# EasyEDA Pro project ProPrj_风扇可调供电_2025-12-10.epro

# Schematic Schematic1
Board Name: fan_control; Create Date: 2025-11-17; Page Name: P1; Project Name: 风扇可调供电; Schematic Name: Schematic1; Update Date: 2025-12-03; Company: 嘉立创EDA; Page Size: A4; Version: V1.0
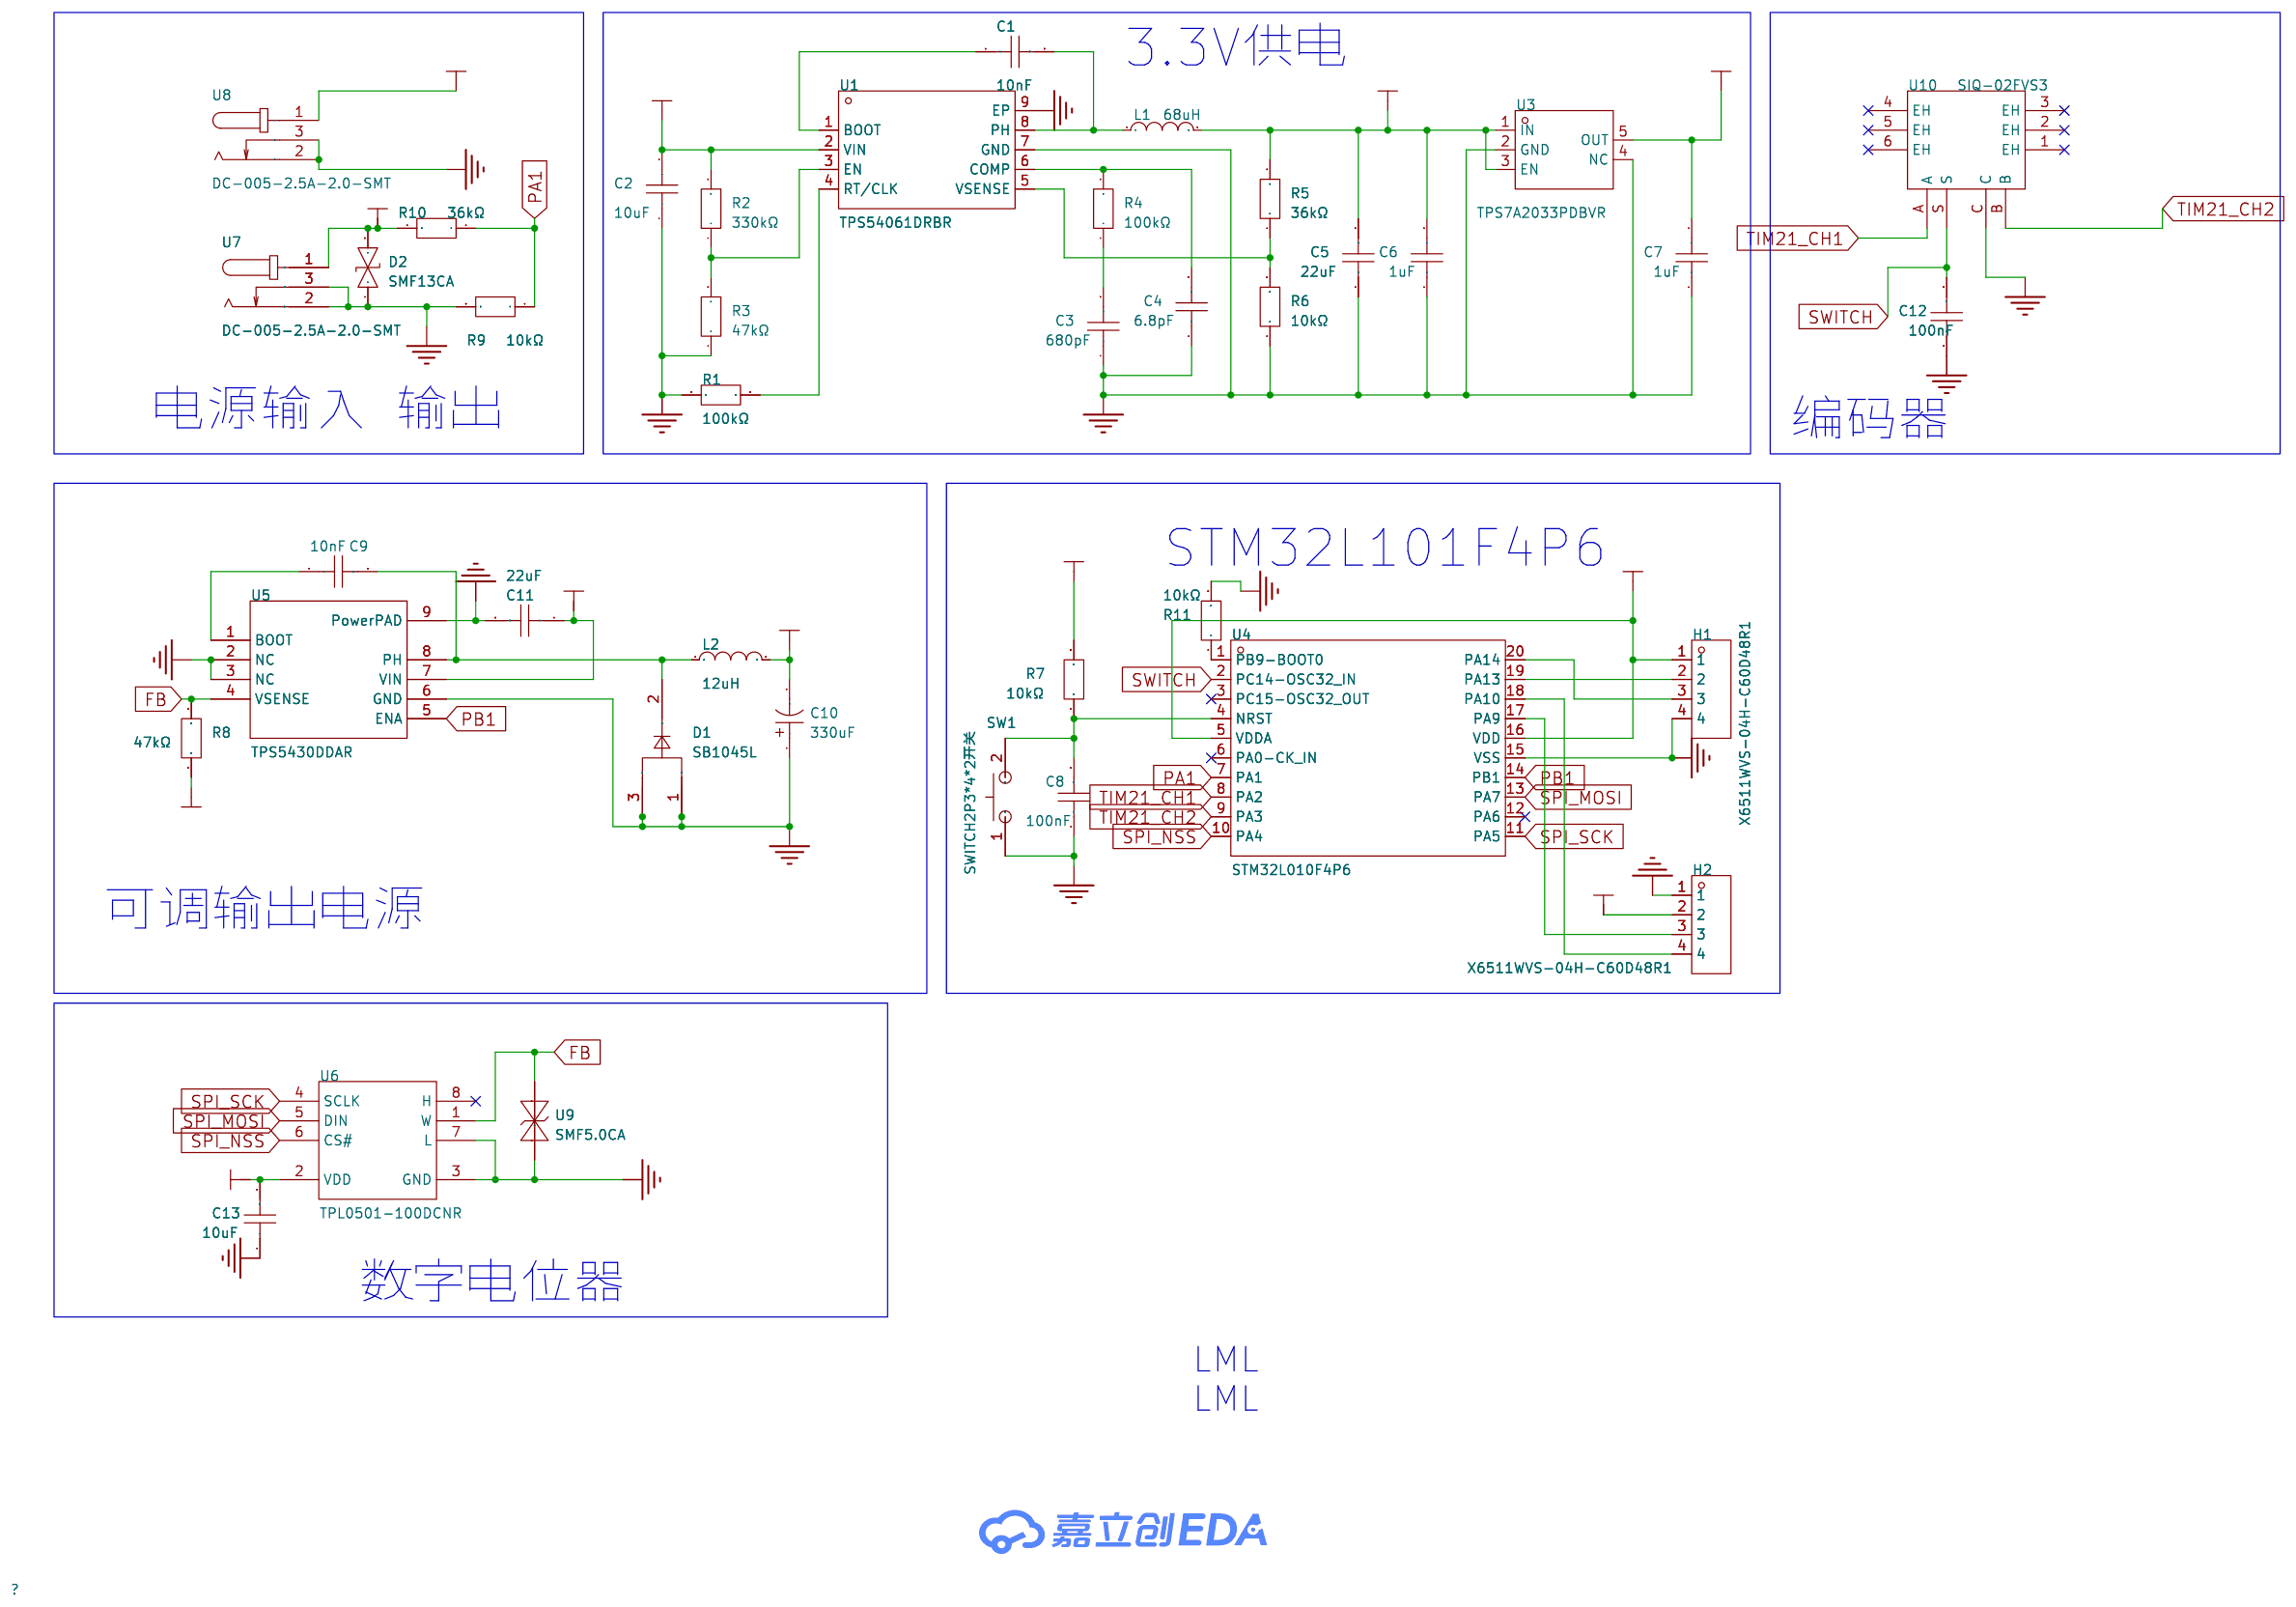
[diagram p0: schematic sheet]

## Parts
C1  10nF  [C0603]
C2  10uF  [C0603]
C3  680pF  [C0603]
C4  6.8pF  [C0603]
C5  22uF  [C0805]
C6  1uF  [C0603]
C7  1uF  [C0603]
C8  100nF  [C0603]
C9  10nF  [C0603]
C10  330uF  [CAP-SMD_BD10.0-L10.3-W10.3-SV331M250G12R7R1Z00ZZ]
C11  22uF  [C0805]
C12  100nF  [C0603]
C13  10uF  [C0603]
D1  SB1045L  [TO-277_3P-L5.4-W4.0-LS6.5-TR]
D2  SMF13CA  [SOD-123FL_L2.7-W1.8-LS3.8-BI]
H1  X6511WVS-04H-C60D48R1  [HDR-SMD_4P-P2.54-V-M-S4.8]
H2  X6511WVS-04H-C60D48R1  [HDR-SMD_4P-P2.54-V-M-S4.8]
L1  68uH  [IND-SMD_L4.5-W4.0_SCCD43]
L2  12uH  [IND-SMD_L12.0-W12.0_744771008]
R1  100kΩ  [R0603]
R2  330kΩ  [R0603]
R3  47kΩ  [R0603]
R4  100kΩ  [R0603]
R5  36kΩ  [R0603]
R6  10kΩ  [R0603]
R7  10kΩ  [R0603]
R8  47kΩ  [R0603]
R9  10kΩ  [R0603]
R10  36kΩ  [R0603]
R11  10kΩ  [R0603]
SW1  SWITCH2P3*4*2开关  [SW-SMD_L3.9-W2.9-P4.15-LS5.0-EH]
U1  TPS54061DRBR  [SON-8_L3.0-W3.0-P0.65-TL-EP]
U3  TPS7A2033PDBVR  [SOT-23-5_L2.9-W1.6-P0.95-LS2.8-BR]
U4  STM32L010F4P6  [TSSOP-20_L6.5-W4.4-P0.65-LS6.4-BL]
U5  TPS5430DDAR  [ESOP-8_L4.9-W3.9-P1.27-LS6.0-TL-EP]
U6  TPL0501-100DCNR  [SOT-23-8_L3.0-W1.7-P0.65-LS2.8-BL]
U7  DC-005-2.5A-2.0-SMT  [DC-IN-TH_XKB_DC-005-2.5A-2.5-SMT]
U8  DC-005-2.5A-2.0-SMT  [DC-IN-TH_XKB_DC-005-2.5A-2.5-SMT]
U9  SMF5.0CA  [SOD-123FL_L2.8-W1.8-LS3.7-BI]
U10  SIQ-02FVS3  [SW-SMD_SIQ-02FVS3_1]

## Library data of the parts
C1 C8 C9 = AC0603KPX7R9BB103: 容值:10nF;精度:±10%;额定电压:50V;温度系数:X7R;; LCSC Part Name: 10nF ±10% 50V; Supplier Part: C2172124; Manufacturer: YAGEO(国巨); Supplier Footprint: 0603; JLCPCB Part Class: 扩展库; Datasheet: https://item.szlcsc.com/datasheet/AC0603KPX7R9BB103/2264190.html; Supplier: LCSC; Tolerance: ±10%; Voltage Rating: 50V; Temperature Coefficient: X7R
C2-C7 C11-C13 = GRM188Z71C475KE21J: 容值:4.7uF;精度:±10%;额定电压:16V;温度系数:X7R;; LCSC Part Name: 4.7uF ±10% 16V; Supplier Part: C3844215; Manufacturer: muRata(村田); Supplier Footprint: 0603; JLCPCB Part Class: 扩展库; Datasheet: https://item.szlcsc.com/datasheet/GRM188Z71C475KE21J/4412698.html; Supplier: LCSC; Tolerance: ±10%; Voltage Rating: 16V; Temperature Coefficient: X7R
C10 = SV331M250G12R7R1Z00ZZ: 容值:330uF;精度:±20%;额定电压:25V;纹波电流:-;等效串联电阻(ESR):-;类型:聚合物;; LCSC Part Name: 330uF ±20% 25V; Supplier Part: C48542934; Manufacturer: 创慧电子; Supplier Footprint: SMD,D10xL12.7mm; JLCPCB Part Class: 扩展库; Datasheet: https://item.szlcsc.com/datasheet/SV331M250G12R7R1Z00ZZ/50804218.html; Supplier: LCSC; Tolerance: ±20%; Voltage Rating: 25V; Type: 聚合物; Pin Spacing: 5mm; Diameter: 10mm; Height - Seated (Max): 12.7mm; Lifetime: 2000hrs@105℃; Operating Temperature: -55℃~+105℃
D1 = SB1045L_C5199106: 二极管配置:独立式;正向压降(Vf):530mV@10A;直流反向耐压(Vr):45V;整流电流:10A;; LCSC Part Name: IF:10A VR:45V VF:0.53V IFSM:150A; Supplier Part: C5199106; Manufacturer: HXY MOSFET(华轩阳电子); Supplier Footprint: TO-277; JLCPCB Part Class: 扩展库; Datasheet: https://atta.szlcsc.com/upload/public/pdf/source/20240930/D1FEAD36E1BD0228299004254FB623C2.pdf; Supplier: LCSC; Diode Configuration: 独立式; Voltage - Forward(Vf@If): 530mV@10A; Voltage - DC Reverse(Vr): 45V; Current - Rectified: 10A; Reverse Leakage Current (Ir): 150uA@45V
D2 = SMF13CA_C19077508: 极性:双向;反向截止电压(Vrwm):13V;钳位电压:21.5V;峰值脉冲电流(Ipp):9.3A@10/1000us;峰值脉冲功率(Ppp):200W@10/1000us;击穿电压:15.9V;; LCSC Part Name: 双向TVS 13V截止 峰值浪涌电流：9.3A@10/1000us; Supplier Part: C19077508; Manufacturer: R+O(宏嘉诚); Supplier Footprint: SOD-123FL; JLCPCB Part Class: Extended Part; Datasheet: https://item.szlcsc.com/datasheet/SMF13CA/20275593.html; Supplier: LCSC; Polarity: 双向; Reverse Stand-Off Voltage (Vrwm): 13V; Clamping Voltage: 21.5V; Peak Pulse Current (Ipp): 9.3A@10/1000us; Peak Pulse Power Dissipation (Ppp): 200W@10/1000us; Voltage - Breakdown: 15.9V; Reverse Leakage Current (Ir): 1uA; Operating Temperature: -55℃~+150℃; level of protection: IEC 61000-4-2; Type: TVS
H1 H2 = X6511WVS-04H-C60D48R1: 插针结构:1x4P;间距:2.54mm;行距:2.54mm;圆针/方针:方针;排数:单排;总PIN位数:4P;额定电流:3A;额定电压:250V;配合针长度:-;塑高:2.5mm;端接针长度:-;触头材质:黄铜;触头镀层:金;工作温度:-40℃~+105℃;颜色:黑色;; LCSC Part Name: 1x4P 间距:2.54mm 方针; Supplier Part: C780062; Manufacturer: XKB Connection(中国星坤); Supplier Footprint: SMD,P=2.54mm; JLCPCB Part Class: Extended Part; Datasheet: https://item.szlcsc.com/datasheet/X6511WVS-04H-C60D48R1/831912.html; Supplier: LCSC; Pin Structure: 1x4P; Pitch: 2.54mm; Row Spacing: 2.54mm; Circluar Pins/Square Pins: 方针; Number of Rows: 单排; Number of Pins: 4P; Current Rating: 3A; Voltage Rating (Max): 250V; Insulation Height: 2.5mm; Contact Material: 黄铜; Contact Plating: 金; Operating Temperature: -40℃~+105℃; Color: 黑色
L1 = 784787680: 电感值:68uH;精度:±25%;饱和电流(Isat):1A;; LCSC Part Name: 68uH ±25% 1A; Supplier Part: C5917525; Manufacturer: Wurth(伍尔特); Supplier Footprint: SMD,7.8x7mm; JLCPCB Part Class: 扩展库; Datasheet: https://www.we-online.com/components/products/datasheet/784787680.pdf; Supplier: LCSC; Tolerance: ±25%; Current - Saturation(Isat): 1A; DC Resistance(DCR): 290mΩ; Ratings: AEC-Q200
L2 = 744771112: 电感值:12uH;精度:±20%;额定电流:3.91A;饱和电流(Isat):4.85A;; LCSC Part Name: 12uH ±20% 4.85A; Supplier Part: C2045656; Manufacturer: Wurth(伍尔特); Supplier Footprint: SMD,12x12mm; JLCPCB Part Class: 扩展库; Datasheet: https://www.we-online.com/components/products/datasheet/744771112.pdf; Supplier: LCSC; Tolerance: ±20%; Current Rating: 3.91A; Current - Saturation(Isat): 4.85A; DC Resistance(DCR): 27mΩ; Ratings: AEC-Q200
R1-R11 = GR0603F180KT5G00: 电阻类型:厚膜电阻;阻值:180kΩ;精度:±1%;功率:100mW;工作电压:75V;温度系数:±100ppm/℃;; LCSC Part Name: 180K ±1%; Supplier Part: C49653111; Manufacturer: GiantOhm(鼎声微电); Supplier Footprint: 0603; JLCPCB Part Class: 扩展库; Datasheet: https://item.szlcsc.com/datasheet/GR0603F180KT5G00/52210696.html; Supplier: LCSC; Type: 厚膜电阻; Tolerance: ±1%; Power(Watts): 100mW; Voltage-Supply(Max): 75V; Temperature Coefficient: ±100ppm/℃; Operating Temperature: -55℃~+155℃
SW1 = SWITCH2P3*4*2开关: Supplier Part: C9900004128; Supplier Footprint: SMD; JLCPCB Part Class: 扩展库; Supplier: LCSC
U1 = TPS54061DRBR: 功能类型:降压型;输出类型:可调;工作电压:4.7V~60V;输出电压:800mV~58V;输出电流:200mA;; LCSC Part Name: 60V 200mA同步降压DC-DC转换器; Supplier Part: C113613; Manufacturer: TI(德州仪器); Supplier Footprint: SON-8-EP(3x3); JLCPCB Part Class: 扩展库; Datasheet: https://www.ti.com/cn/lit/gpn/tps54061; Supplier: LCSC; Function: 降压型; Output Type: 可调; Input Voltage: 4.7V~60V; Output Voltage: 800mV~58V; Output Current: 200mA; Switching Frequency: 1.1MHz; Operating Temperature: -40℃~+150℃@(TJ); Synchronous Rectification: 是; Number of Outputs: 1; Topology: 降压式; Switch tube (built-in/external): 内置
U3 = TPS7A2033PDBVR: 输出类型:固定;最大输入电压:6V;输出电压:3.3V;输出电流:300mA;输出极性:正极;; LCSC Part Name: 具有高 PSRR 的 300mA、超低噪声、低 IQ、低压降 (LDO) 线性稳压器; Supplier Part: C2862740; Manufacturer: TI(德州仪器); Supplier Footprint: SOT-23-5; JLCPCB Part Class: 扩展库; Datasheet: https://www.ti.com/cn/lit/gpn/tps7a20; Supplier: LCSC; Output Type: 固定; Maximum Input Voltage: 6V; Output Voltage: 3.3V; Output Current: 300mA; Dropout Voltage: 140mV@(300mA); standby current: 15uA; Feature: 防静电保护；软启动；浪涌保护；低ESR；热保护(TSD)；欠压闭锁；过流保护(OCP)；带使能；防倒灌; Operating Temperature: -40℃~+125℃@(Tj); Output Polarity: 正极; Number of Outputs: 1
U4 = STM32L010F4P6: CPU内核:ARM-M系列;CPU最大主频:32MHz;应用领域:-;; LCSC Part Name: 超低功耗超值系列Arm Cortex-M0+ MCU，具有16-KB Flash存储器和32 MHz CPU; Supplier Part: C529415; Manufacturer: ST(意法半导体); Supplier Footprint: TSSOP-20; JLCPCB Part Class: 扩展库; Datasheet: https://item.szlcsc.com/datasheet/STM32L010F4P6/549643.html; Supplier: LCSC; CPU Core: ARM-M系列; CPU Maximum Speed: 32MHz; Program Storage Size: 16KB; Program Memory Type: FLASH; Number of I/O: 16; ADC (Bit): 12bit; Voltage - Supply: 1.8V~3.6V
U5 = TPS5430DDAR: 功能类型:降压型;工作电压:5.5V~36V;输出电压:1.221V~32.04V;输出电流:3A;输出类型:可调;; LCSC Part Name: 宽输入范围、3A输出电流的降压转换器; Supplier Part: C9864; Manufacturer: TI(德州仪器); Supplier Footprint: SOIC-8-EP; JLCPCB Part Class: 基础库; Datasheet: https://www.ti.com/lit/ds/symlink/tps5430.pdf; Supplier: LCSC; Function: 降压型; Voltage - Supply: 5.5V~36V; Output Voltage: 1.221V~32.04V; Output Current: 3A; Frequency - Switching: 500kHz; Operating Temperature: -40℃~+125℃@(TJ); Synchronous Rectifier: 否; Number of Outputs: 1; Topology: 降压式; Quiescent Current: 4.4mA; Switch tube (built-in/external): 内置; Output Type: 可调
U6 = TPL0501-100DCNR: 电阻值(欧姆):100kΩ;接口类型:SPI;供电电压:2.7V~5.5V;精度:±20%;; Supplier Part: C131323; Manufacturer: TI(德州仪器); Supplier Footprint: SOT-23-8; JLCPCB Part Class: 扩展库; Datasheet: https://www.ti.com/cn/lit/gpn/tpl0501-100; Supplier: LCSC; Resistance Value (Ohms): 100kΩ; Number of Taps: 256; Interface Type: SPI; Number of Channels: 1; Supply Voltage: 2.7V~5.5V; Precision: ±20%; Temperature Coefficient (Typ): 35ppm/℃; Operating Temperature: -40℃~+125℃
U7 U8 = DC-005-2.5A-2.0-SMT: 连接器类型:DC电源插座;安装方式:卧贴;触点内径:2mm;触点外径:6.5mm;额定电流:2.5A;额定电压:24V;工作温度:-;; LCSC Part Name: DC电源插座 内径:2mm 外径:6.5mm; Supplier Part: C2880543; Manufacturer: XKB Connection(中国星坤); Supplier Footprint: SMD; JLCPCB Part Class: 扩展库; Datasheet: https://item.szlcsc.com/datasheet/DC-005-2.5A-2.0-SMT/3091035.html; Supplier: LCSC; Connector Type: DC电源插座; Mounting Type: 卧贴; Inside Contact Diameter: 2mm; Outside Contact Diameter: 6.5mm; Current Rating: 2.5A; Voltage Rating (Max): 24V
U9 = SMF5.0CA: 反向截止电压(Vrwm):5V;最大钳位电压:9.2V;峰值脉冲电流(Ipp):21.7A;峰值脉冲功率(Ppp):200W;击穿电压:6.4V;; Supplier Part: C2985633; Manufacturer: KUU; Supplier Footprint: SOD-123FL; JLCPCB Part Class: 扩展库; Datasheet: https://atta.szlcsc.com/upload/public/pdf/source/20211206/852276409897768D6E4CD85BFA43719B.pdf; Supplier: LCSC; Reverse Stand-Off Voltage (Vrwm): 5V; Maximum Clamping Voltage: 9.2V; Peak Pulse Current (Ipp): 21.7A; Peak Pulse Power Dissipation (Ppp): 200W; Breakdown Voltage: 6.4V; Reverse Leakage Current (Ir): 400uA; Type: TVS
U10 = SIQ-02FVS3: LCSC Part Name: 拨轮滚轮旋转编码器开关; Supplier Part: C2925423; Manufacturer: MITSUMI(美上美); Supplier Footprint: SMD; JLCPCB Part Class: 扩展库; Datasheet: https://atta.szlcsc.com/upload/public/pdf/source/20220728/2FBC1A98A06DC86460FC69DAE20456FC.pdf; Supplier: LCSC

## Nets
+3.3V: C7.2 C13.2 H1.1 H2.2 R7.2 U3.5(OUT) U4.5(VDDA) U4.16(VDD) U6.2(VDD)
+3.6V: C5.2 C6.2 L1.2 R5.2 U3.1(IN) U3.3(EN)
+8V: C10.2 D2.2(A) L2.2 R8.1 R10.2 U7.1
+12V: C2.2 C11.1 R2.2 U1.2(VIN) U5.7(VIN) U8.1
GND: C2.1 C3.1 C4.1 C5.1 C6.1 C7.1 C8.1 C10.1 C11.2 C12.1 C13.1 D1.1(A) D1.3(A) D2.1(K) H1.4 H2.1 R1.1 R3.1 R6.1 R9.2 R11.2 SW1.1 U1.7(GND) U1.9(EP) U3.2(GND) U3.4(NC) U4.15(VSS) U5.2(NC) U5.3(NC) U5.6(GND) U5.9(PowerPAD) U6.3(GND) U6.7(L) U7.2 U7.3 U8.2 U8.3 U9.1 U10.C
FB: R8.2 U5.4(VSENSE) U6.1(W) U9.2
PA1: R9.1 R10.1 U4.7(PA1)
PB1: U4.14(PB1) U5.5(ENA)
SPI_MOSI: U4.13(PA7) U6.5(DIN)
SPI_NSS: U4.10(PA4) U6.6(CS#)
SPI_SCK: U4.11(PA5) U6.4(SCLK)
SWITCH: C12.2 U4.2(PC14-OSC32_IN) U10.S
TIM21_CH1: U4.8(PA2) U10.A
TIM21_CH2: U4.9(PA3) U10.B
$1N331: C1.2 L1.1 U1.8(PH)
$1N337: C1.1 U1.1(BOOT)
$1N630: R2.1 R3.2 U1.3(EN)
$1N740: C4.2 R4.2 U1.6(COMP)
$1N792: C3.2 R4.1
$1N1065: R5.1 R6.2 U1.5(VSENSE)
$1N1657: R1.2 U1.4(RT/CLK)
$1N2746: H1.2 U4.19(PA13)
$1N2752: H1.3 U4.20(PA14)
$1N2774: C8.2 R7.1 SW1.2 U4.4(NRST)
$1N3503: C9.1 U5.1(BOOT)
$1N6525: H2.3 U4.17(PA9)
$1N6531: H2.4 U4.18(PA10)
$1N12295: C9.2 D1.2(C) L2.1 U5.8(PH)
$1N12915: R11.1 U4.1(PB9-BOOT0)

Not connected (* = marked no-connect by the designer): U4 3(PC15-OSC32_OUT)* 6(PA0-CK_IN)* 12(PA6)*; U6 8(H)*; U10 1(EH)* 2(EH)* 3(EH)* 4(EH)* 5(EH)* 6(EH)*

## Notes on the sheet
- 3.3V供电
- 电源输入 输出
- 编码器
- STM32L101F4P6
- 可调输出电源
- 数字电位器
- LML
- LML

# Board PCB1
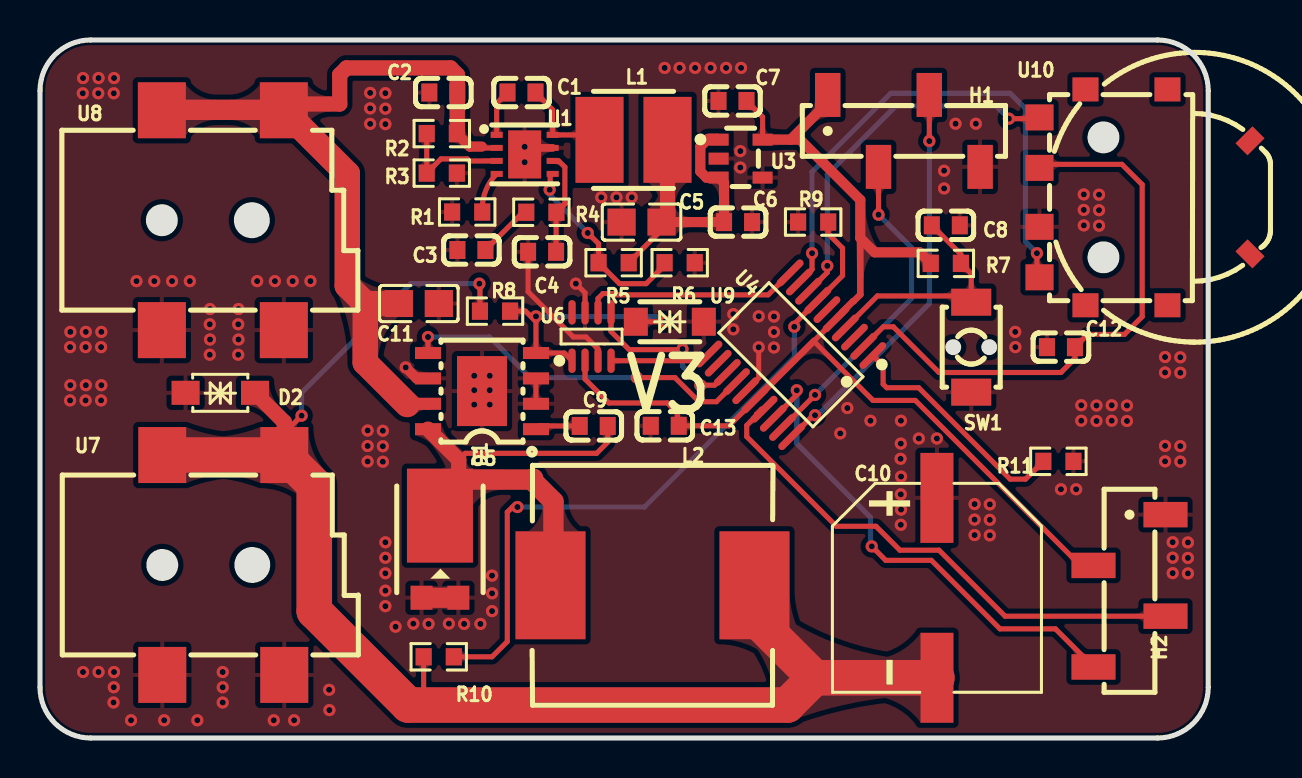
[diagram p1: board, top side]
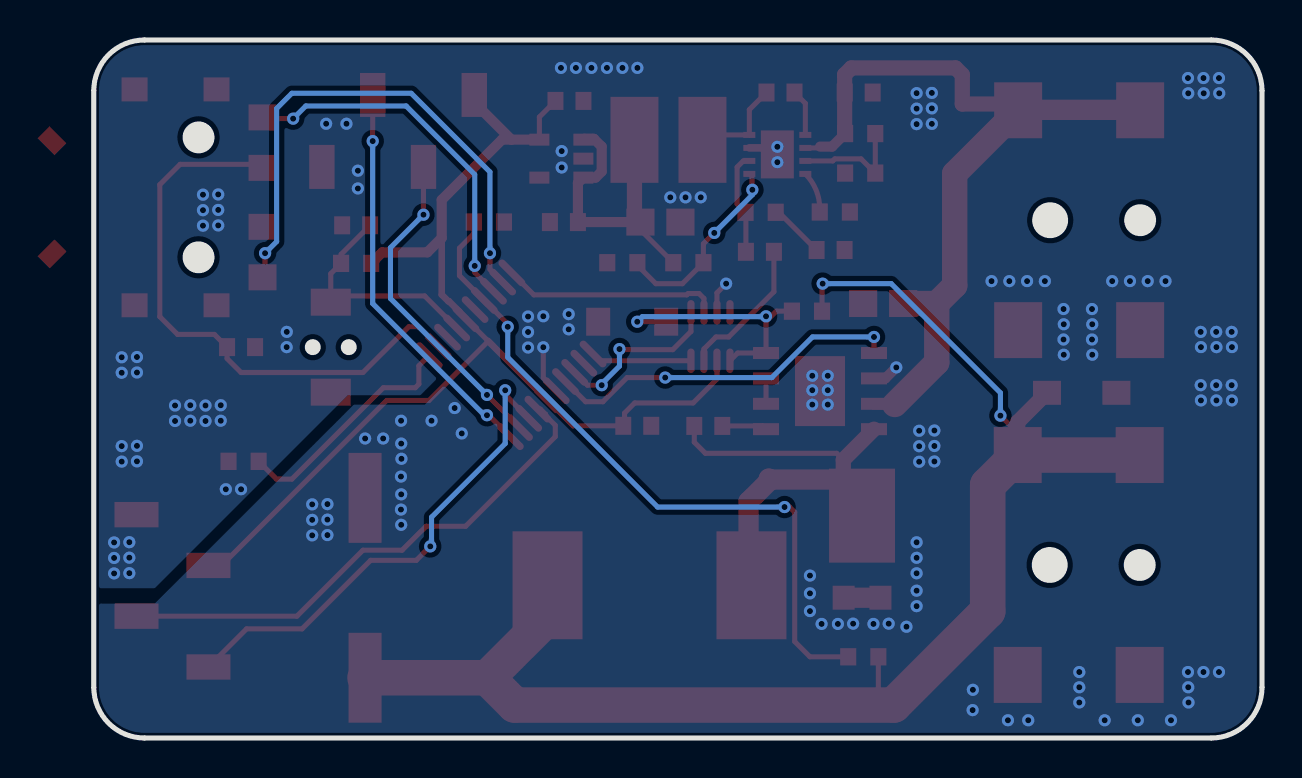
[diagram p2: board, bottom side, seen from below]

Outline 58.42 x 34.92 mm; copper layers: Top Layer, Bottom Layer. Coordinates in mm from the lower left corner of the outline.
Outline path: 0,32.38 0,2.54 arc(0.74,0.74) 2.54,0 55.88,0 arc(57.68,0.74) 58.42,2.54 58.42,32.38 arc(57.68,34.18) 55.88,34.92 2.54,34.92 arc(0.74,34.18) 0,32.38
Stack: Top Layer 0.035mm / Dielectric1 1.51mm FR4 er 4.5 / Bottom Layer 0.035mm

## Design rules (mm)
template: 自定义配置
spacing copperThickness1oz (default): track to track 0.102, other pairs 0.152 to 0.3
spacing copperThickness2oz: track to track 0.203, other pairs 0.152 to 0.3
spacing 12v: track to track 0.305, other pairs 0.051 to 0.305
track width copperThickness1oz (default): min 0.127, default 0.254, max 2.54
track width copperThickness2oz: min 0.203, default 0.254, max 2.54
differential pair differentialPair (default): width min 0.127, default 0.254, max 2.54; gap min 0.152, default 0.152
via viaSize (default): diameter min 0.5, default 0.61, max 10; hole min 0.3, default 0.305, max 6.3
pour e314 uses copperRegion

## Placement (name value [footprint] x y rotation side)
C1  10nF  [C0603]  24.08 32.3 0 top
C2  10uF  [C0603]  20.17 32.3 0 top
C3  680pF  [C0603]  21.57 24.42 0 top
C4  6.8pF  [C0603]  25.11 24.33 0 top
C5  22uF  [C0805]  30.08 25.81 0 top
C6  1uF  [C0603]  34.91 25.81 180 top
C7  1uF  [C0603]  34.63 31.88 0 top
C8  100nF  [C0603]  45.3 25.65 180 top
C9  10nF  [C0603]  27.69 15.61 0 top
C10  330uF  [CAP-SMD_BD10.0-L10.3-W10.3-SV331M250G12R7R1Z00ZZ]  44.85 7.51 270 top
C11  22uF  [C0805]  18.94 21.74 0 top
C12  100nF  [C0603]  51.05 19.56 0 top
C13  10uF  [C0603]  31.24 15.62 0 top
D1  SB1045L  [TO-277_3P-L5.4-W4.0-LS6.5-TR]  20 9.07 270 top
D2  SMF13CA  [SOD-123FL_L2.7-W1.8-LS3.8-BI]  9.02 17.27 0 top
H1  X6511WVS-04H-C60D48R1  [HDR-SMD_4P-P2.54-V-M-S4.8]  43.2 30.37 0 top
H2  X6511WVS-04H-C60D48R1  [HDR-SMD_4P-P2.54-V-M-S4.8]  54.48 7.37 270 top
L1  68uH  [IND-SMD_L4.5-W4.0_SCCD43]  29.68 29.93 0 top
L2  12uH  [IND-SMD_L12.0-W12.0_744771008]  30.63 7.64 0 top
R1  100kΩ  [R0603]  21.36 26.32 0 top
R2  330kΩ  [R0603]  20.09 30.24 0 top
R3  47kΩ  [R0603]  20.09 28.26 180 top
R4  100kΩ  [R0603]  25.07 26.3 0 top
R5  36kΩ  [R0603]  28.69 23.78 0 top
R6  10kΩ  [R0603]  31.99 23.78 180 top
R7  10kΩ  [R0603]  45.3 23.75 180 top
R8  47kΩ  [R0603]  22.75 21.36 0 top
R9  10kΩ  [R0603]  38.66 25.81 180 top
R10  36kΩ  [R0603]  19.94 4.06 180 top
R11  10kΩ  [R0603]  50.93 13.84 0 top
SW1  SWITCH2P3*4*2开关  [SW-SMD_L3.9-W2.9-P4.15-LS5.0-EH]  46.57 19.56 90 top
U1  TPS54061DRBR  [SON-8_L3.0-W3.0-P0.65-TL-EP]  24.24 29.2 0 top
U3  TPS7A2033PDBVR  [SOT-23-5_L2.9-W1.6-P0.95-LS2.8-BR]  35.04 28.99 180 top
U4  STM32L010F4P6  [TSSOP-20_L6.5-W4.4-P0.65-LS6.4-BL]  37.55 19.17 135 top
U5  TPS5430DDAR  [ESOP-8_L4.9-W3.9-P1.27-LS6.0-TL-EP]  22.1 17.36 180 top
U6  TPL0501-100DCNR  [SOT-23-8_L3.0-W1.7-P0.65-LS2.8-BL]  27.58 20.09 0 top
U7  DC-005-2.5A-2.0-SMT  [DC-IN-TH_XKB_DC-005-2.5A-2.5-SMT]  9.17 8.66 0 top
U8  DC-005-2.5A-2.0-SMT  [DC-IN-TH_XKB_DC-005-2.5A-2.5-SMT]  9.14 25.91 0 top
U9  SMF5.0CA  [SOD-123FL_L2.8-W1.8-LS3.7-BI]  31.5 20.83 180 top
U10  SIQ-02FVS3  [SW-SMD_SIQ-02FVS3_1]  55.25 27.05 270 top

## Footprints (pads in the part's own frame, mm; a bottom-side part is the same pattern mirrored in y, then rotated)
C0603
  rect 0.8x0.9 smd: 1(-0.7,0) 2(0.7,0)
C0805
  rect 1.41x1.35 smd: 1(-1,0) 2(1,0)
CAP-SMD_BD10.0-L10.3-W10.3-SV331M250G12R7R1Z00ZZ
  rect 4.5x1.65 smd: 1(-4.5,0) 2(4.5,0)
DC-IN-TH_XKB_DC-005-2.5A-2.5-SMT
  rect 2.4x2.8 smd: 1(-3.05,5.5) 1(3.05,5.5) 2(-3.05,-5.5) 3(3.05,-5.5)
ESOP-8_L4.9-W3.9-P1.27-LS6.0-TL-EP
  rect 1.3x0.6 smd: 1(-2.7,1.905) 2(-2.7,0.635) 3(-2.7,-0.635) 4(-2.7,-1.905) 5(2.7,-1.905) 6(2.7,-0.635) 7(2.7,0.635) 8(2.7,1.905)
  rect 2.5x3.5 smd: 9(0,0)
HDR-SMD_4P-P2.54-V-M-S4.8
  rect 1.27x2.2 smd: 1(-3.81,1.8) 2(-1.27,-1.8) 3(1.27,1.8) 4(3.81,-1.8)
IND-SMD_L4.5-W4.0_SCCD43
  rect 2.4x4.3 smd: 1(-1.7,0) 2(1.7,0)
IND-SMD_L12.0-W12.0_744771008
  rect 3.5x5.4 smd: 1(-5.1,0) 2(5.1,0)
R0603
  rect 0.806x0.864 smd: 1(-0.753,0) 2(0.753,0)
SOD-123FL_L2.7-W1.8-LS3.8-BI
  rect 1.4x1.2 smd: 1(-1.735,0) 2(1.735,0)
SOD-123FL_L2.8-W1.8-LS3.7-BI
  rect 1.2x1.4 smd: 1(-1.7,0) 2(1.7,0)
SON-8_L3.0-W3.0-P0.65-TL-EP
  rect 0.6x0.3 smd: 1(-1.4,0.976) 2(-1.4,0.325) 3(-1.4,-0.325) 4(-1.4,-0.976) 5(1.4,-0.976) 6(1.4,-0.325) 7(1.4,0.325) 8(1.4,0.976)
  rect 1.65x2.4 smd: 9(0,0)
SOT-23-5_L2.9-W1.6-P0.95-LS2.8-BR
  rect 1x0.6 smd: 1(1.1,-0.95) 2(1.1,0) 3(1.1,0.95) 4(-1.1,0.95) 5(-1.1,-0.95)
SOT-23-8_L3.0-W1.7-P0.65-LS2.8-BL
  oval 0.364x1.222 smd: 1(-0.975,-1.211) 2(-0.325,-1.211) 3(0.325,-1.211) 4(0.975,-1.211) 5(0.975,1.211) 6(0.325,1.211) 7(-0.325,1.211) 8(-0.975,1.211)
SW-SMD_L3.9-W2.9-P4.15-LS5.0-EH
  rect 1.35x2 smd: 1(-2.25,0) 2(2.25,0)
SW-SMD_SIQ-02FVS3_1
  rect 1.2x1.3 smd: 1(5.4,-2.964) 2(5.4,1.136) 5(-5.4,1.136) 6(-5.4,-2.964)
  rect 0.85x1.2 smd rot 135: 3(2.829,5.264)
  rect 0.85x1.2 smd rot 45: 4(-2.829,5.264)
  rect 1.3x1.4 smd: A(-4,-5.264) B(4,-5.264) C(1.475,-5.264) S(-1.475,-5.264)
TO-277_3P-L5.4-W4.0-LS6.5-TR
  rect 1.2x1.1 smd: 1(2.054,0.92) 3(2.054,-0.92)
  rect 4.7x3.3 smd: 2(-2.054,0)
TSSOP-20_L6.5-W4.4-P0.65-LS6.4-BL
  oval 0.364x1.742 smd: 1(-2.925,-2.871) 2(-2.275,-2.871) 3(-1.625,-2.871) 4(-0.975,-2.871) 5(-0.325,-2.871) 6(0.325,-2.871) 7(0.975,-2.871) 8(1.625,-2.871) 9(2.275,-2.871) 10(2.925,-2.871) 11(2.925,2.871) 12(2.275,2.871) 13(1.625,2.871) 14(0.975,2.871) 15(0.325,2.871) 16(-0.325,2.871) 17(-0.975,2.871) 18(-1.625,2.871) 19(-2.275,2.871) 20(-2.925,2.871)

## Nets
As in the schematic.

Pads without a net: U4 3 6 12; U6 8; U10 1 2 3 4 5 6

## Via types
v1: diameter 0.61, hole 0.305, Top Layer to Bottom Layer, 179 vias

## Routing (per net, layer and track width the routed paths; a pad name or vN(x,y) marks a point on that pad's centre or on a via; arc(x,y) is an arc through that point)
+3.3V: length 57.2
  Top Layer w0.254: U4.5 38.71,19.87 38.71,19.84 41.66,16.89 43.77,16.89 52.03,8.64 H2.2 ; U6.2 27.26,17.96 28.45,16.76 31.37,16.76 31.88,16.26 31.88,15.62 34.46,15.62 U4.16 ; C7.2 36.14,31.07 U3.5
  Top Layer w0.33: U4.5 40.14,21.3 40.14,21.33 40.66,21.85 40.69,21.85 41.02,22.18 41.02,25.02 ; U4.16 38.71,19.87
  Top Layer w0.508: 39.39,31.79 37.54,29.94 ; 37.54,29.94 38.01,29.94 41.02,26.92 41.02,25.02 41.74,24.3 43.99,24.3 44.55,23.75 ; 37.54,29.94 U3.5
+3.6V: length 15.8
  Top Layer w0.254: R5.2 31.08,25.43 C5.2
  Top Layer w0.508: U3.3 34.21,27.77 C6.2 C5.2 ; 33.94,28.04 33.33,28.04 33.02,28.35 33.02,29.59 33.41,29.98 33.9,29.98 U3.1
  Top Layer w0.762: C5.2 31.38,26.11 L1.2
+8V: length 74.3
  Top Layer w0.254: R10.2 19.19,2.41 ; R8.1 22,22.7 v1(21.97,22.73) ; v1(13.08,16.13) 12.34,15.39 12.22,15.39 U7.1
  Top Layer w0.762: 12.22,15.39 12.22,15.81 D2.2
  Top Layer w1.778: 38.74,3.01 35.73,6.02 L2.2 ; 38.74,3.01 C10.2 ; 38.74,3.01 37.37,1.65 18.41,1.65 13.72,6.35 13.72,12.66 U7.1 U7.1
  Bottom Layer w0.254: v1(21.97,22.73) 18.54,22.73 13.08,17.27 v1(13.08,16.13)
+12V: length 42
  Top Layer w0.254: U1.2 22.16,29.52 22.1,29.59
  Top Layer w0.508: 18.36,16.69 19.4,16.69 19.4,16.72 ; R2.2 21.5,29.59 22.1,29.59
  Top Layer w0.762: 12.09,31.43 12.38,31.72 14.99,31.72 14.99,33.19 15.33,33.53 20.53,33.53 20.87,33.19 C2.2 20.87,30.3 arc(20.86,30.27) R2.2
  Top Layer w1.016: 12.09,31.43 5.99,31.43
  Top Layer w1.27: 16.26,21.74 15.37,22.64 15.37,28.23 U8.1 ; 16.26,21.74 16.26,18.79 18.36,16.69 ; 16.26,21.74 C11.1
GND: length 17.2
  Top Layer w0.254: U5.2 U5.3 ; v1(35.94,19.55) 35.94,18.02 U4.15 ; C4.1 24.41,22.33 26.67,20.07 27.31,20.07 27.91,19.47 U6.3 ; v1(26.8,22.73) 27.26,22.27 U6.7
  Top Layer w0.381: U1.7 24.29,29.52 v1(24.24,29.58)
  Top Layer w0.508: v1(18.29,18.54) 18.84,17.99 19.4,17.99
  Top Layer w1.016: D1.1 D1.3
  vias: v1(1.52,20.32) v1(1.5,19.56) v1(1.52,17.65) v1(1.5,16.89) v1(2.14,32.26) v1(2.15,33.02) v1(2.15,3.3) v1(2.29,20.32) v1(2.28,19.56) v1(2.29,17.65) v1(2.28,16.89) v1(2.93,33.02) v1(2.91,32.26) v1(2.93,3.3) v1(3.07,20.32) v1(3.05,19.56) v1(3.07,17.65) v1(3.05,16.89) v1(3.7,33.02) v1(3.69,32.26) v1(3.7,3.3) v1(3.69,2.54) v1(3.68,1.78) v1(4.55,0.89) v1(4.83,22.86) v1(5.72,22.86) v1(6.21,0.89) v1(6.6,22.86) v1(7.49,22.86) v1(7.87,0.89) v1(8.5,21.46) v1(8.49,20.7) v1(8.5,19.94) v1(8.49,19.18) v1(9.14,3.3) v1(9.14,2.54) v1(9.14,1.78) v1(9.93,21.46) v1(9.91,20.7) v1(9.93,19.94) v1(9.91,19.18) v1(10.86,22.86) v1(11.75,22.86) v1(11.69,0.89) v1(12.64,22.86) v1(12.71,0.89) v1(13.53,22.86) v1(14.46,2.41) v1(14.47,1.4) v1(16.38,15.39) v1(16.38,14.61) v1(16.38,13.84) v1(16.51,32.28) v1(16.51,31.5) v1(16.51,30.73) v1(17.15,15.37) v1(17.15,14.6) v1(17.15,13.82) v1(17.27,32.26) v1(17.27,31.49) v1(17.27,30.71) v1(17.27,9.79) v1(17.27,9.02) v1(17.27,8.24) v1(17.27,7.37) v1(17.27,6.6) v1(17.78,5.57) v1(18.67,5.72) v1(19.43,5.71) v1(20.45,5.72) v1(21.21,5.71) v1(21.72,18.12) v1(21.72,17.4) v1(21.72,16.68) v1(22.02,5.71) v1(22.49,18.12) v1(22.49,17.4) v1(22.49,16.68) v1(22.61,8.13) v1(22.61,7.24) v1(22.61,6.35) v1(24.24,28.81) v1(28.07,27.05) v1(28.83,27.05) v1(29.59,27.05) v1(31.24,33.53) v1(31.98,33.53) v1(32.76,33.53) v1(33.53,33.53) v1(34.31,33.53) v1(34.67,21.21) v1(34.67,20.45) v1(35.02,29.37) v1(35.02,28.54) v1(35.06,33.53) v1(35.94,21.1) v1(36.7,21.09) v1(36.7,20.31) v1(36.7,19.54) v1(40.02,15.24) v1(40.37,16.51) v1(41.53,15.88) v1(43.05,14.73) v1(43.03,13.97) v1(43.05,12.19) v1(43.05,10.67) v1(43.05,15.88) v1(43.06,13.08) v1(43.06,11.43) v1(43.95,14.99) v1(44.85,14.99) v1(45.21,28.38) v1(45.21,27.5) v1(45.78,30.73) v1(46.74,11.7) v1(46.74,10.93) v1(46.74,10.15) v1(46.8,30.73) v1(47.5,11.69) v1(47.5,10.92) v1(47.5,10.14) v1(48.77,20.32) v1(48.77,19.56) v1(51.05,12.45) v1(51.82,12.45) v1(52.07,16.65) v1(52.07,15.88) v1(52.2,27.2) v1(52.2,26.42) v1(52.2,25.65) v1(52.83,16.64) v1(52.83,15.86) v1(52.96,27.18) v1(52.96,26.41) v1(52.96,25.63) v1(53.59,16.65) v1(53.59,15.88) v1(54.36,16.64) v1(54.36,15.86) v1(56.26,19.06) v1(56.26,18.29) v1(56.26,14.62) v1(56.26,13.84) v1(56.64,9.8) v1(56.64,9.02) v1(56.64,8.25) v1(57.02,19.05) v1(57.02,18.27) v1(57.02,14.61) v1(57.02,13.83) v1(57.4,9.79) v1(57.4,9.01) v1(57.4,8.24)
FB: length 12.9
  Top Layer w0.254: U6.1 26.22,19.26 U5.4 24.8,20.83 24.28,21.36 R8.2 ; 29.92,20.83 v1(31.24,20.83)
  Bottom Layer w0.254: v1(31.24,20.83) 30.99,21.08 24.82,21.08 v1(24.8,21.1)
PA1: length 35.1
  Top Layer w0.254: R9.1 39.42,25.23 40.13,24.51 40.13,23.13 U4.7 37.72,20.72 v1(37.72,20.57) ; v1(23.88,11.56) 23.62,11.56 23.37,11.3 23.37,4.83 22.61,4.06 R10.1
  Bottom Layer w0.254: v1(37.72,20.57) 37.72,19.05 30.23,11.56 v1(23.88,11.56)
PB1: length 18
  Top Layer w0.254: 19.4,19.26 v1(19.4,20.07) ; v1(29.84,18.03) 31.75,18.03 32.96,16.83 33.82,16.83 34.83,17.83
  Bottom Layer w0.254: v1(19.4,20.07) 22.48,20.07 24.51,18.03 v1(29.84,18.03)
SPI_MOSI: length 8.7
  Top Layer w0.254: U4.13 33.73,17.65 v1(33.02,17.65) ; 32.13,19.43 29.46,19.43 28.56,20.34 U6.5
  Bottom Layer w0.254: v1(33.02,17.65) 33.02,17.72 32.13,18.61 v1(32.13,19.46)
SPI_NSS: length 10.9
  Top Layer w0.254: U6.6 27.91,21.99 28.15,22.24 28.7,22.24 28.76,22.17 36.41,22.17 U4.10
SPI_SCK: length 5
  Top Layer w0.254: U4.11 33.12,18.88 U6.4
SWITCH: length 28.6
  Top Layer w0.254: 50.36,28.65 50.41,28.7 54.1,28.7 55.12,27.69 55.12,21.08 54.23,20.19 52.39,20.19 C12.2 51.75,18.99 51.05,18.29 44.96,18.29 42.67,20.57 42.17,20.57 U4.2
TIM21_CH1: length 19
  Top Layer w0.254: v1(39.37,23.62) 39.37,23.29 38.43,22.35 ; v1(48.45,30.99) 50.17,30.99 50.36,31.18
  Bottom Layer w0.254: v1(39.37,23.62) 39.37,28.19 42.8,31.62 47.82,31.62 v1(48.45,30.99)
TIM21_CH2: length 27.2
  Top Layer w0.254: v1(49.85,24.26) 49.85,23.69 50.36,23.18 ; U4.9 38.61,23.45 v1(38.61,24.26)
  Bottom Layer w0.254: v1(38.61,24.26) 38.61,28.32 42.54,32.26 48.51,32.26 49.28,31.5 49.28,24.83 v1(49.85,24.26)
$1N331: length 4.9
  Top Layer w0.254: C1.2 25.64,31.44 U1.8 27.73,30.17 L1.1
$1N337: length 2.3
  Top Layer w0.254: C1.1 22.84,31.75 U1.1
$1N630: length 5.8
  Top Layer w0.254: U1.3 21.47,28.87 21.36,28.97 20.05,28.97 R3.2 R2.1
$1N740: length 5.2
  Top Layer w0.254: C4.2 25.81,26.26 arc(25.81,26.28) R4.2 26.25,26.73 26.25,28.56 25.94,28.87 U1.6
$1N792: length 2.8
  Top Layer w0.254: C3.2 24.05,26.19 arc(24.17,26.28) R4.1
$1N1065: length 8.9
  Top Layer w0.254: v1(27.39,25.27) 27.93,24.73 R5.1 28.98,22.73 30.31,22.73 31.07,23.49 31.07,23.62 31.24,23.78
  Bottom Layer w0.254: v1(25.49,27.43) 25.49,27.18 v1(27.39,25.27)
$1N1657: length 2.1
  Top Layer w0.254: R1.2 22.12,26.48 arc(22.3,27.43) U1.4
$1N2746: length 16
  Top Layer w0.254: 41.93,28.19 v1(41.93,26.18) ; U4.19 38.76,17.16 v1(38.76,17.17)
  Bottom Layer w0.254: v1(41.93,26.18) 43.58,24.53 43.58,21.99 v1(38.76,17.17)
$1N2752: length 19.7
  Top Layer w0.254: 44.47,31.79 v1(44.47,29.87) ; v1(38.76,16.15) 38.66,16.15 U4.20
  Bottom Layer w0.254: v1(38.76,16.15) 38.88,16.15 44.47,21.74 v1(44.47,29.87)
$1N2774: length 11.8
  Top Layer w0.254: U4.4 41.88,22.12 46.25,22.12 SW1.2 46.57,23.23 R7.1 46.05,24.2 C8.2
$1N3503: length 2.3
  Top Layer w0.254: C9.1 24.97,15.61 U5.1
$1N6525: length 26.5
  Top Layer w0.254: H2.3 48.26,6.1 44.96,9.4 43,9.4 41.81,10.59 39.83,10.59 35.34,15.08 35.34,15.64 35.82,16.12 35.82,16.18 35.83,16.19 35.83,16.2 36.08,16.45 36.21,16.45
$1N6531: length 24.6
  Top Layer w0.254: 36.67,16 37.85,17.17 v1(37.85,17.4) ; v1(41.59,9.59) 42.29,8.89 44.58,8.89 48.01,5.46 50.78,5.46 H2.4
  Bottom Layer w0.254: 41.53,9.78 41.53,11.05 37.85,14.73 v1(37.85,17.4)
$1N12295: length 21.3
  Top Layer w0.254: C9.2 28.39,14.8 27.84,14.25 21.27,14.25 20.94,13.92
  Top Layer w0.762: 19.4,15.45 20.94,13.92 20.94,12.93
  Top Layer w1.016: 20.94,12.93 24.62,12.93 24.66,12.98 24.66,12.85 25.68,11.83 25.68,7.64
$1N12915: length 12
  Top Layer w0.254: U4.1 42.16,18.62 42.16,17.71 42.34,17.53 43.94,17.53 48.51,12.95 49.28,12.95 R11.1

## Copper pours and planes (outline as drawn; the poured copper is in the pictures)
GND on Top Layer: -1.65,36.32 60.2,36.32 60.2,-0.89 -1.65,-0.89
GND on Bottom Layer: -0.13,35.05 60.07,35.05 60.07,-1.14 -0.13,-1.14

Small or netless copper shapes (teardrops, artwork), in the pictures only: 149 on Top Layer, 22 on Bottom Layer

## Text on the board
Top Silkscreen Layer: V3
